# Altium schematic sheet MCU.SchDoc: Gemini++
size Letter; Author: Ye-Sheng Kuo; Revision: 7; SheetTotal: 4
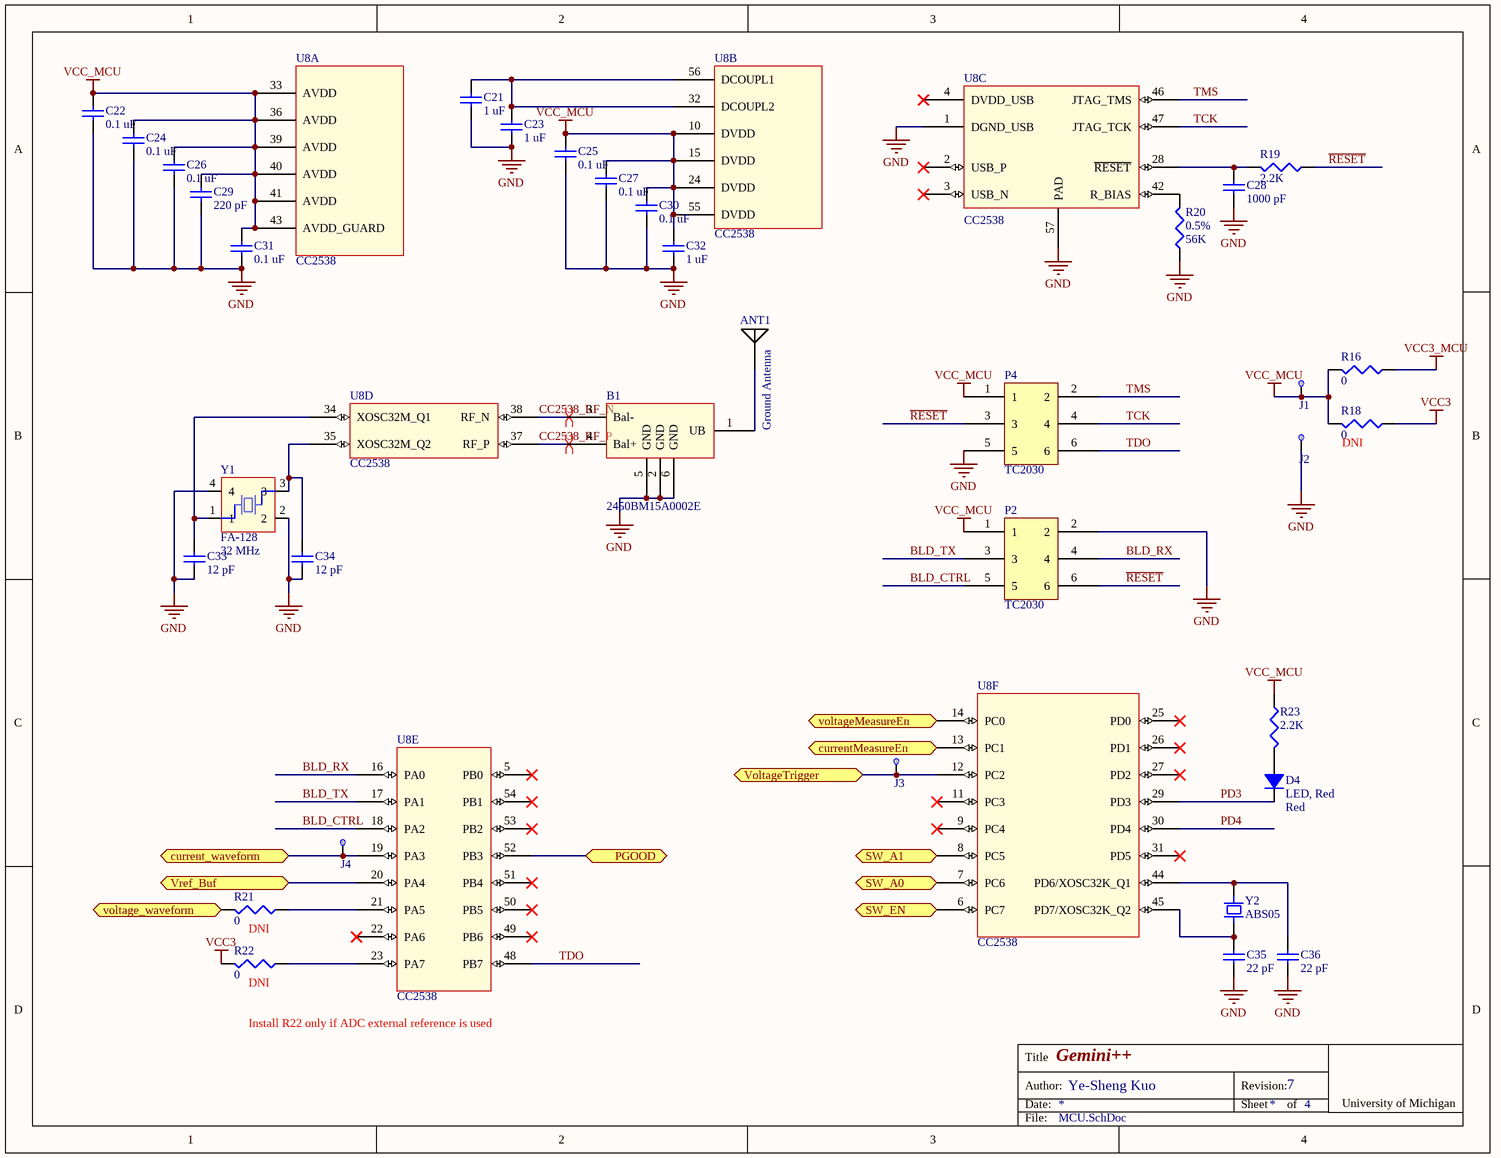
[diagram p0: MCU.SchDoc]

## Parts
ANT1  Ground Antenna  [Chip Antenna]
B1  2450BM15A0002E  [2450BM15A0002]
C21  value 1 uF  [0402]  (hidden comment: Ceramic capacitor)
C22  value 0.1 uF  [0402]  (hidden comment: Ceramic capacitor)
C23  value 1 uF  [0402]  (hidden comment: Ceramic capacitor)
C24  value 0.1 uF  [0402]  (hidden comment: Ceramic capacitor)
C25  value 0.1 uF  [0402]  (hidden comment: Ceramic capacitor)
C26  value 0.1 uF  [0402]  (hidden comment: Ceramic capacitor)
C27  value 0.1 uF  [0402]  (hidden comment: Ceramic capacitor)
C28  value 1000 pF  [0402]  (hidden comment: Ceramic capacitor)
C29  value 220 pF  [0402]  (hidden comment: Ceramic capacitor)
C30  value 0.1 uF  [0402]  (hidden comment: Ceramic capacitor)
C31  value 0.1 uF  [0402]  (hidden comment: Ceramic capacitor)
C32  value 1 uF  [0402]  (hidden comment: Ceramic capacitor)
C33  value 12 pF  [0402]  (hidden comment: Ceramic capacitor)
C34  value 12 pF  [0402]  (hidden comment: Ceramic capacitor)
C35  value 22 pF  [0402]  (hidden comment: Ceramic capacitor)
C36  value 22 pF  [0402]  (hidden comment: Ceramic capacitor)
D4  LED, Red  Color: Red  [0402 - DIODE]
J1  RCU 0603 SMD Testpoint  [RCU_0603]  (value not drawn)
J2  RCU 0603 SMD Testpoint  [RCU_0603]  (value not drawn)
J3  RCU 0603 SMD Testpoint  [RCU_0603]  (value not drawn)
J4  RCU 0603 SMD Testpoint  [RCU_0603]  (value not drawn)
P2  TC2030  [TC2030-IDC-NLFP]
P4  TC2030  [TC2030-IDC-NLFP]
R16  value 0  [0603]  (hidden comment: Chip resistor)
R18  value 0  [0603]  (hidden comment: Chip resistor)
R19  value 2.2K  [0402]  (hidden comment: Chip resistor)
R20  value 56K  tolerance: 0.5%  [0402]  (hidden comment: Chip resistor)
R21  value 0  [0402]  (hidden comment: Chip resistor)
R22  value 0  [0402]  (hidden comment: Chip resistor)
R23  value 2.2K  [0402]  (hidden comment: Chip resistor)
U8  CC2538  [QFN56]  (parts A,B,C,D,E,F of 6)
Y1  FA-128  frequency: 32 MHz  [FA-128]
Y2  ABS05  [ABS05]

## Ports
current_waveform, currentMeasureEn, PGOOD, SW_A0, SW_A1, SW_EN, voltage_waveform, voltageMeasureEn, VoltageTrigger, Vref_Buf

## Nets
GND: B1.2(GND) B1.5(GND) B1.6(GND) C21.2 C22.2 C23.2 C24.2 C25.2 C26.2 C27.2 C28.2 C29.2 C30.2 C31.2 C32.2 C33.1 C34.1 C35.2 C36.2 J2.1(TB) P2.2 P4.5 R20.2 U8.1(DGND_USB) U8.57(PAD) Y1.2 Y1.4
VCC3: R18.2 R22.1
VCC3_MCU: R16.2
VCC_MCU: C22.1 C24.1 C25.1 C26.1 C27.1 C29.1 C30.1 C31.1 C32.1 J1.1(TB) P2.1 P4.1 R16.1 R18.1 R23.2 U8.10(DVDD) U8.15(DVDD) U8.24(DVDD) U8.33(AVDD) U8.36(AVDD) U8.39(AVDD) U8.40(AVDD) U8.41(AVDD) U8.43(AVDD_GUARD) U8.55(DVDD)
BLD_CTRL: P2.5 U8.18(PA2)
BLD_RX: P2.4 U8.16(PA0)
BLD_TX: P2.3 U8.17(PA1)
CC2538_RF_N: B1.3(Bal-) U8.38(RF_N)
CC2538_RF_P: B1.4(Bal+) U8.37(RF_P)
current_waveform: J4.1(TB) U8.19(PA3) ; port current_waveform
currentMeasureEn: U8.13(PC1) ; port currentMeasureEn
PD3: D4.2 U8.29(PD3)
PD4: U8.30(PD4)
PGOOD: U8.52(PB3) ; port PGOOD
~{RESET}: P2.6 P4.3 R19.2
SW_A0: U8.7(PC6) ; port SW_A0
SW_A1: U8.8(PC5) ; port SW_A1
SW_EN: U8.6(PC7) ; port SW_EN
TCK: P4.4 U8.47(JTAG_TCK)
TDO: P4.6 U8.48(PB7)
TMS: P4.2 U8.46(JTAG_TMS)
voltage_waveform: R21.1 ; port voltage_waveform
voltageMeasureEn: U8.14(PC0) ; port voltageMeasureEn
VoltageTrigger: J3.1(TB) U8.12(PC2) ; port VoltageTrigger
Vref_Buf: U8.20(PA4) ; port Vref_Buf
NetANT1_1: ANT1.1 B1.1(UB)
NetC21_1: C21.1 C23.1 U8.32(DCOUPL2) U8.56(DCOUPL1)
NetC28_1: C28.1 R19.1 U8.28(~{RESET})
NetC33_2: C33.2 U8.34(XOSC32M_Q1) Y1.1
NetC34_2: C34.2 U8.35(XOSC32M_Q2) Y1.3
NetC35_1: C35.1 U8.45(PD7/XOSC32K_Q2) Y2.2
NetC36_1: C36.1 U8.44(PD6/XOSC32K_Q1) Y2.1
NetD4_1: D4.1 R23.1
NetR20_1: R20.1 U8.42(R_BIAS)
NetR21_2: R21.2 U8.21(PA5)
NetR22_2: R22.2 U8.23(PA7)

Not connected (* = marked no-connect by the designer): U8 2(USB_P)* 3(USB_N)* 4(DVDD_USB)* 5(PB0)* 9(PC4)* 11(PC3)* 22(PA6)* 25(PD0)* 26(PD1)* 27(PD2)* 31(PD5)* 49(PB6)* 50(PB5)* 51(PB4)* 53(PB2)* 54(PB1)*

## Layout directives
differential pair: CC2538_RF_N, CC2538_RF_P

## Notes on the sheet
- (near R18) DNI
- (near R21) DNI
- (near R22) DNI
- Install R22 only if ADC external reference is used
- Title
- Date:
- Author:
- Revision:
- Sheet
- of
- University of Michigan
- File:

## Library data of the parts
ANT1 = Ground Antenna: 2.4GHz Surface Mount Device (SMD) On Ground Antenna, 50 Ohms; Supplier 1: RichardsonRFPD; Supplier Part Number 1: FR05-S1-N-0102B
B1 = 2450BM15A0002E: 2.45 GHz Balun for TI CC253X; Supplier 1: Digi-Key; Supplier Part Number 1: 712-1536-1-ND
C21 C23 C32 = C_1u_16V_0402_ceramic: Ceramic capacitor, 1 uF, 16V, 0402 package; Manufacture: TDK; tolerance: 10%; Temperature rating: X5R; voltage rated: 16 V; package: 0402; Supplier 1: Digi-Key; Supplier Part Number 1: 445-4978-1-ND
C22 C24-C27 C30 C31 = C_0.1u_10V_0402_ceramic: Ceramic capacitor, 0.1u, 0402 package; Manufacture: TDK; voltage rated: 10 V; tolerance: 10%; Supplier 1: Digi-Key; Supplier Part Number 1: 445-1265-1-ND; package: 0402
C28 = C_1000p_50V_0402_ceramic: Ceramic capacitor, 1000 pF, 0402 package; Manufacture: TDK; voltage rated: 50 V; tolerance: 10%; package: 0402; Supplier 1: Digi-Key; Supplier Part Number 1: 445-6846-1-ND
C29 = C_220p_50V_0402_ceramic: Ceramic capacitor, 220 pF, 0402 package; Manufacture: Johanson; voltage rated: 50 V; tolerance: 10%; package: 0402; Temperature: X7R; Supplier 1: Digi-Key; Supplier Part Number 1: 445-1254-1-ND
C33 C34 = C_12p_0402_ceramic: Ceramic capacitor, 12 pF, 0402 package; Manufacture: Johanson; voltage rated: 50 V; tolerance: 2%; package: 0402; Supplier 1: Digi-Key; Supplier Part Number 1: 712-1256-1-ND
C35 C36 = C_22p_0402_ceramic: Ceramic capacitor, 22 pF, 0402 package; Manufacture: Johanson; voltage rated: 50 V; tolerance: 2%; package: 0402; Supplier 1: Digi-Key; Supplier Part Number 1: 712-1274-1-ND
D4 = D_LED_RED_0402: LED, Red, 0402; package: 0402; Supplier 1: Digi-Key; Supplier Part Number 1: 511-1593-1-ND
J1-J4 = Testpoint-0603: 0603 SMD Testpoint; Supplier 1: Digi-Key; Supplier Part Number 1: A106145CT-ND
P2 P4 = TC2030: TC2030-MCP-NL
R16 R18 = R_0_0603: Chip resistor, 0, 0603 package; package: 0603; Supplier 1: Digi-Key; Supplier Part Number 1: 541-0.0GCT-ND
R19 R23 = R_2.2K_0402: Chip resistor, 2.2K, 0402 package; tolerance: 1%; power: 1/16 W; package: 0402; Supplier 1: Digi-Key; Supplier Part Number 1: 541-2.20KLCT-ND
R20 = R_56K_0402: Chip resistor, 56K, 0402 package; power: 1/16 W; Temperature coefficient: 25 ppm/C; package: 0402; Supplier 1: Digi-Key; Supplier Part Number 1: P56KDECT-ND
R21 R22 = R_0_0402: Chip resistor, 0, 0402 package; package: 0402; Supplier 1: Digi-Key; Supplier Part Number 1: 541-0.0YBCT-ND
U8 = CC2538: A Powerful System-On-Chip for 2.4-GHz IEEE 802.15.4, 6LoWPAN  and ZigBee Applications; Supplier 1: Digi-Key; Supplier Part Number 1: 296-35797-1-ND
Y1 = FA-128: MHz Range Crystal Unit; Load capatance: 10 pF; ESR: 60; stability: 20 ppm; Supplier 1: Digi-Key; Supplier Part Number 1: SER3800CT-ND
Y2 = ABS05: 32768 Hz SMD Low profile crystal; Supplier 1: Digi-Key; Supplier Part Number 1: 535-11899-1-ND